# Altium schematic sheet Aux_Connectors.SchDoc
size A4; SheetNumber: 2; SheetTotal: 2
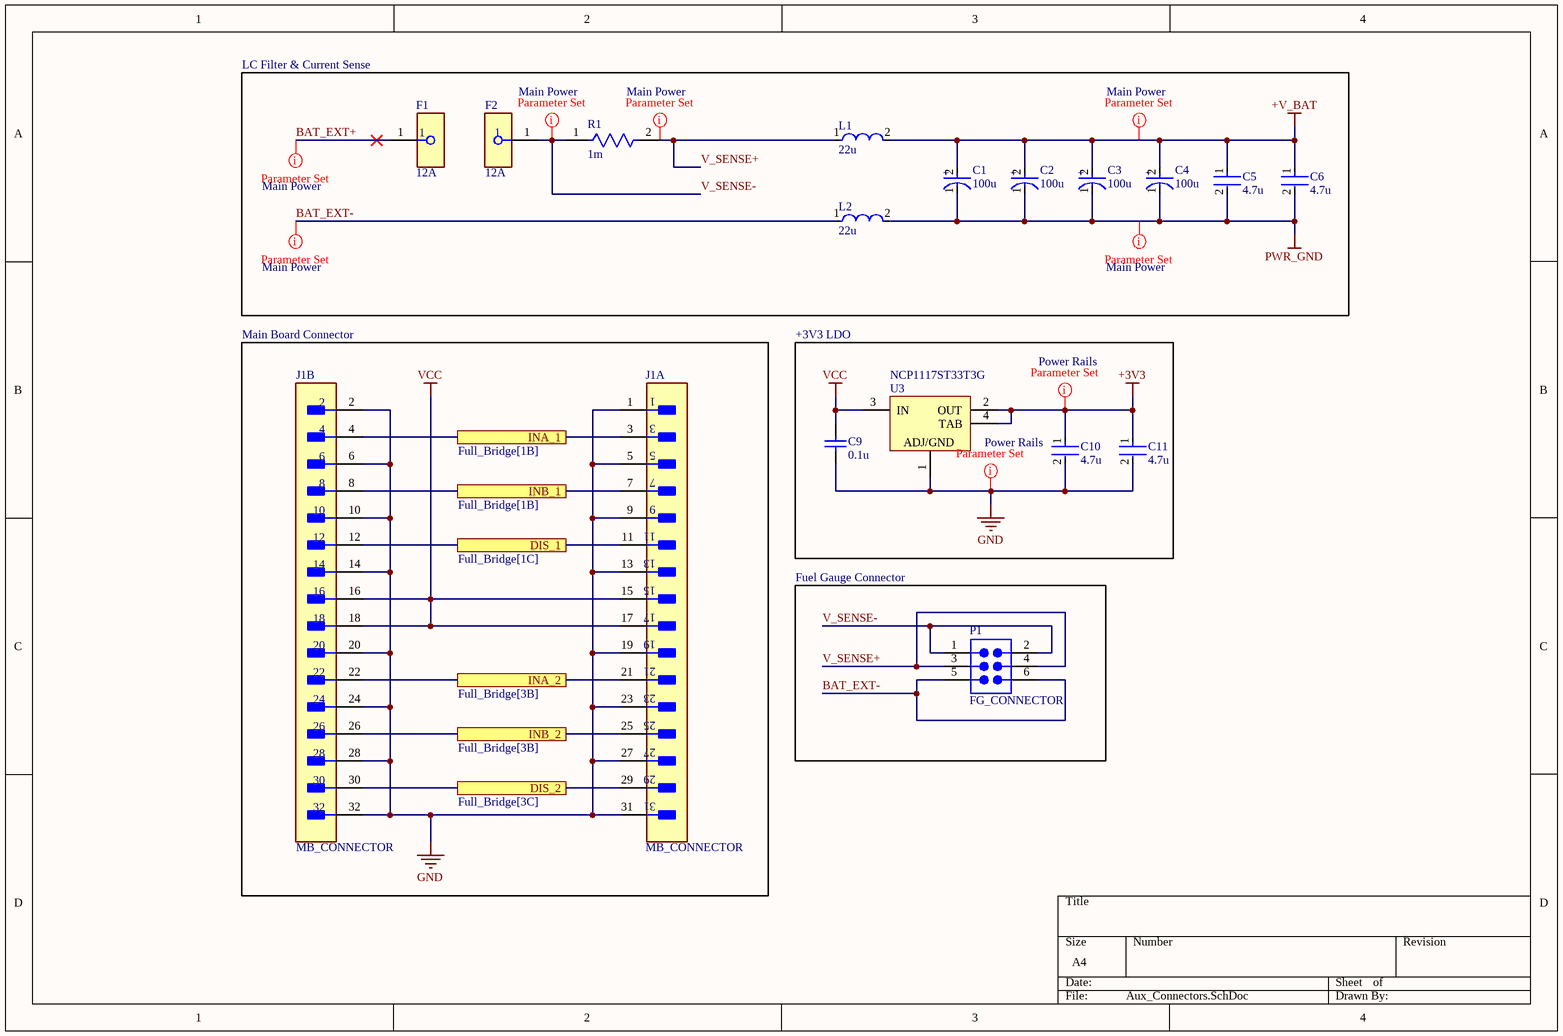
[diagram p0: Aux_Connectors.SchDoc]

## Parts
C1  100u  [FP-EEHA-G-MFG]
C2  100u  [FP-EEHA-G-MFG]
C3  100u  [FP-EEHA-G-MFG]
C4  100u  [FP-EEHA-G-MFG]
C5  4.7u  [FP-GRM31C-0_2-e0_3_0_8-IPC_C]
C6  4.7u  [FP-GRM31C-0_2-e0_3_0_8-IPC_C]
C9  0.1u  [CAPC2013X145X48NL20T23]
C10  4.7u  [FP-GRM31C-0_2-e0_3_0_8-IPC_C]
C11  4.7u  [FP-GRM31C-0_2-e0_3_0_8-IPC_C]
F1  12A  [FP-8040_0001-MFG]
F2  12A  [FP-8040_0001-MFG]
J1  MB_CONNECTOR  [FP-MTSW-116-22-G-D-315-MFG]  (parts A,B of 2)
L1  22u  [FP-PA2247_223NLT-MFG]
L2  22u  [FP-PA2247_223NLT-MFG]
P1  FG_CONNECTOR  [SMTC-MTSW-103-07-X-D-244]
R1  1m  [FP-WSLF2512-0_43-MFG]
U3  NCP1117ST33T3G  [ONSC-SOT-223-4-318H-01_A_V]

## Blocks framed on the sheet
LC Filter & Current Sense: C1-C6 F1 F2 L1 L2 R1
Main Board Connector: J1
+3V3 LDO: C9-C11 U3
Fuel Gauge Connector: P1

## Ports
DIS_1 (see Full_Bridge[1C]), DIS_2 (see Full_Bridge[3C]), INA_1 (see Full_Bridge[1B]), INA_2 (see Full_Bridge[3B]), INB_1 (see Full_Bridge[1B]), INB_2 (see Full_Bridge[3B])

## Nets
+3V3: C10.1 C11.1 U3.2(OUT) U3.4(TAB)
+V_BAT: C1.2(A) C2.2(A) C3.2(A) C4.2(A) C5.1 C6.1 L1.2
GND: C9.1 C10.2 C11.2 J1.1 J1.2 J1.5 J1.6 J1.9 J1.10 J1.13 J1.14 J1.19 J1.20 J1.23 J1.24 J1.27 J1.28 J1.31 J1.32 U3.1(ADJ/GND)
PWR_GND: C1.1(C) C2.1(C) C3.1(C) C4.1(C) C5.2 C6.2 L2.2
VCC: C9.2 J1.15 J1.16 J1.17 J1.18 U3.3(IN)
BAT_EXT+: F1.1
BAT_EXT-: L2.1 P1.5 P1.6
DIS_1: J1.11 J1.12 ; port DIS_1
DIS_2: J1.29 J1.30 ; port DIS_2
INA_1: J1.3 J1.4 ; port INA_1
INA_2: J1.21 J1.22 ; port INA_2
INB_1: J1.7 J1.8 ; port INB_1
INB_2: J1.25 J1.26 ; port INB_2
V_SENSE+: L1.1 P1.3 P1.4 R1.2
V_SENSE-: F2.1 P1.1 P1.2 R1.1

## Layout directives
net class Main Power: +V_BAT, BAT_EXT+, BAT_EXT-, PWR_GND, V_SENSE+, V_SENSE-
net class Power Rails: +3V3, GND

## Notes on the sheet
- (in symbol CMP-05428-000952-1) +

## Library data of the parts
C1-C4 = CMP-05428-000952-1: Conductive Polymer Hybrid Aluminum Electrolytic Capacitors 100uF ±20% 50V RADIAL TH 10x9.5mm
C5 C6 C10 C11 = CMP-06035-057352-1: Chip Multilayer Ceramic Capacitors for General Purpose, 1206, 4.7uF, X7R, 15%, 20%, 50V; Height: 1.6mm; Capacitance: 4.7uF; Radiation Hardening: No; Min Operating Temperature: -55°C; Tolerance: 20%; Packaging: Tape and Reel; Case Code (Imperial): 1206; Mount: Surface Mount; Termination: SMD/SMT; Case/Package: 1206; Depth: 1.6mm; Width: 0.063inch; Max Operating Temperature: 125°C; Thickness: 0.071inch; Voltage Rating (DC): 50V; Package Quantity: 2000; Voltage Rating: 50V; Lead Free: Lead Free; Length: 3.2mm; Case Code (Metric): 3216; Dielectric: X7R
C9 = CMP-2007-01705-1: Part Number: VJ0805Y104KXAMR; Manufacturer: Vitramon
F1 F2 = CMP-26292-000011-1: FUSE CLIP CARTRIDGE 600V 32A PCB; Material: Copper; Fuse Size: 1/4" Dia x 1-1/4" L (6.35mm x 31.8mm); Number of Circuits: 1; Color: Silver; Orientation: Horizontal; Current Rating: 32A; Packaging: Bulk; Min Operating Temperature: -55°C; Max Operating Temperature: 125°C; Width: 7.2mm; Weight: 0.070548oz; Length: 8mm; Radiation Hardening: No; REACH SVHC: No SVHC; Termination: PC Pin; Package Quantity: 1000; Depth: 8.2mm; Fuse Current: 32A; Voltage Rating (DC): 600V; Mount: PCB; Height: 14.3mm; Voltage Rating (AC): 600V; Contact Plating: Tin; Voltage: 600V; Contact Material: Copper; Series: CQP
J1 = CMP-02766-000676-1: CONN HEADER VERT 32POS 2.54MM; Contact Plating: Gold; Lead Free: Lead Free; Contact Material: Bronze; Number of Rows: 2
L1 L2 = CMP-16293-000010-1: FIXED IND 22UH 16A 15.8MOHM SMD
P1 = CMP-1024-00096-1: Modified .025" SQ Post Header, Through-hole, Vertical, -55 to 125 degC, 2.54 mm Pitch, 6-Pin, Male, RoHS; Manufacturer: Samtec; PartNumber: MTSW-103-07-G-D-244; Pitch: 2.54 mm; PackageVersion: BI, 2/1987; ComponentLink3Description: Package Specification; PackageDescription: Assembly .025" [.64] SQ Post Terminal Strip; PackageReference: MTSW-103-07-X-D-244; Temperature Range: -55 to 125 degC; RoHS: True; ComponentLink2URL: http://www.samtec.com/documents/webfiles/pdf/MTSW.PDF; ComponentLink3URL: http://www.samtec.com/documents/webfiles/cpdf/MTSW-XXX-XX-X-X-XXXX-XX-XXX-MKT1.pdf; ComponentLink2Description: Datasheet; ComponentLink1URL: http://www.samtec.com; ComponentLink1Description: Manufacturer URL; Mounting Technology: Through-hole; Orientation: Vertical; DatasheetVersion: F-214
R1 = CMP-02407-013110-1: RES 0.001 OHM 1% 5W 2512; Resistance: 1mR; Temperature Coefficient: 170ppm/°C; Series: WSLF; RoHS Compliant: Yes; Min Operating Temperature: -65°C; Features: Moisture Resistant; Number of Terminations: 2; Case Code (Metric): 6432; Lead Free: Lead Free; Tolerance: 1%; Case Code (Imperial): 2512; Width: 0.125inch; Max Operating Temperature: 170°C; Case/Package: 2512; Resistor Type: Metal Element; Ratings: AEC-Q200; Packaging: Cut Tape; Height: 0.024inch; Max Power Dissipation: 5W; Length: 0.25inch
U3 = CMP-1679-00010-1: Low-Dropout Positive Fixed Voltage Regulator, 1 A, 3.3 V Output Voltage, 0 to 125 degC, 4-Pin SOT-223 (318H-01), Pb-Free, Tape and Reel; Resistance: 220 kohm; Type (Resistor): Thick Film; Voltage Rating: 75 V; Tolerance: 1%; Case\Package: 0603; Power Rating: 100 mW; Width: 0.85 mm; Weight: 7.1E-05 oz; ComponentLink2URL: http://www.onsemi.com/pub_link/Collateral/NCP1117-D.PDF; RoHSCompliant: true; Height: 0.45 mm; PackageDescription: 4-Pin Small Outline Transistor, Body 6.5 x 3.5 mm, Pitch 2.3 mm; ComponentLink1Description: Manufacturer URL; ComponentLink1URL: http://www.onsemi.com/; PackageReference: SOT-223-4-318H-01_A; Max Operating Temperature: 155 degC; Packaging: Tape and Reel; REACH SVHC: Unknown; Length: 1.55 mm; Package Quantity: 5000; Radiation Hardening: No; Min Operating Temperature: -55 degC; DatasheetVersion: Rev. 27, 09/2014; Mount: Surface Mount; Case Code (Imperial): 0603; Case Code (Metric): 1608; ComponentLink2Description: Datasheet